# Altium schematic sheet Nucleo.SchDoc: Nucelo Shield Pinsor
size A4; Author: Tabajdi Máté; Organization: BME - AUT; DocumentNumber: 1; Revision: 19.; SheetNumber: 1; SheetTotal: 3
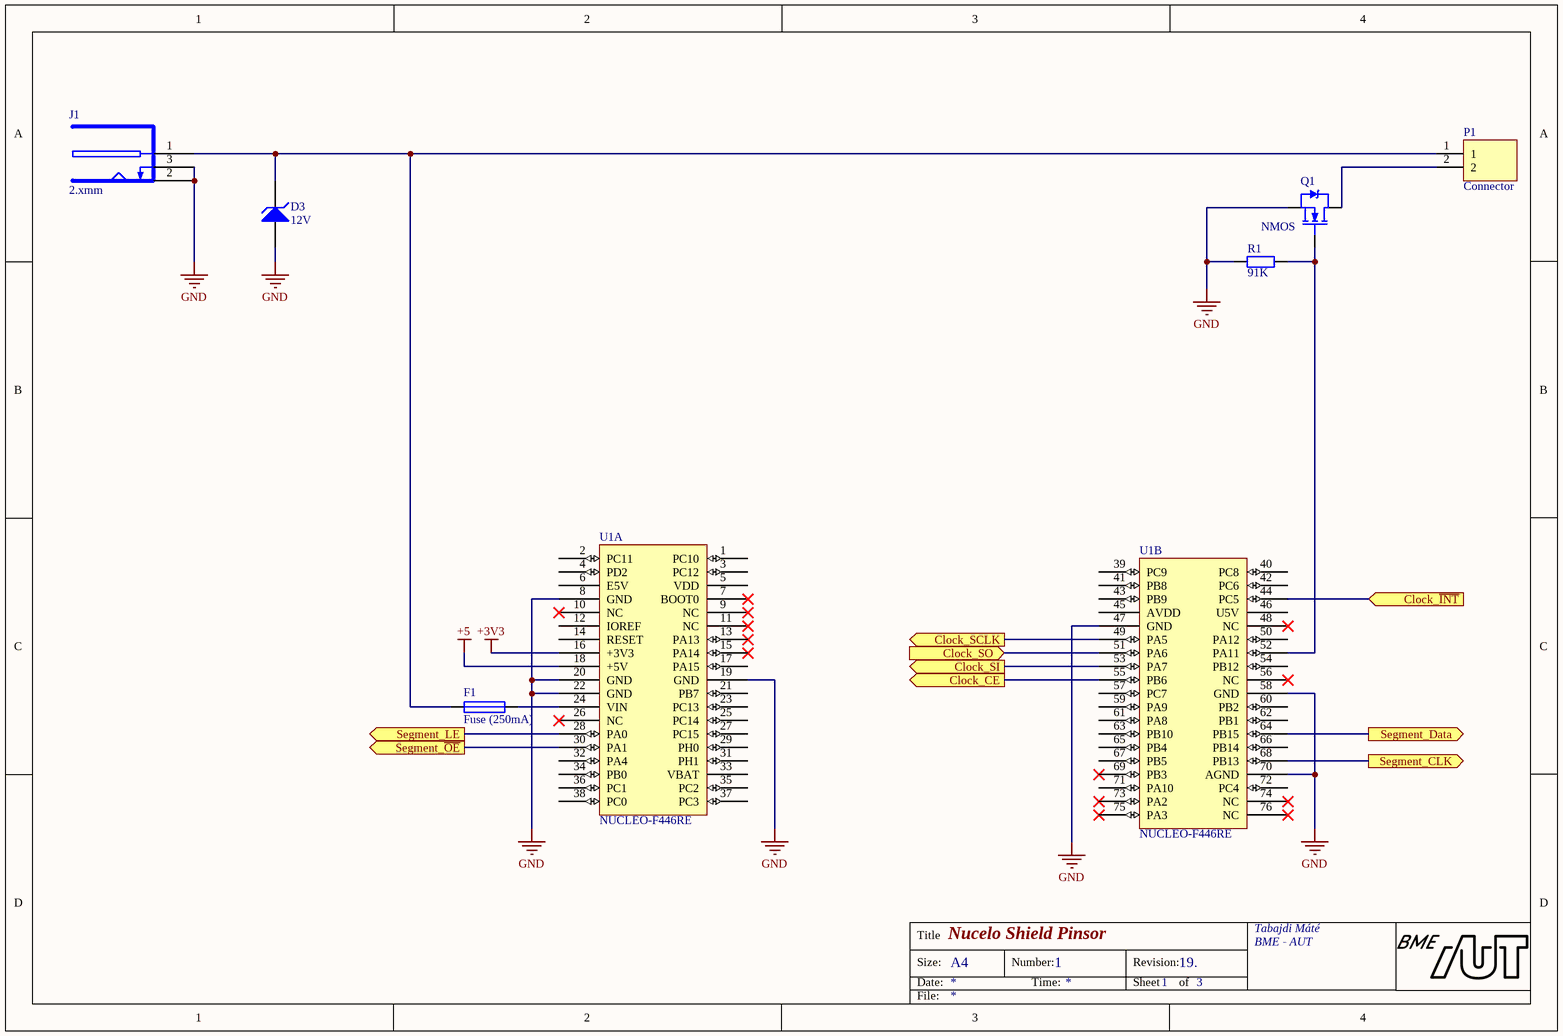
[diagram p0: Nucleo.SchDoc]

## Parts
D3  12V  [FP_SOD323-F]
F1  Fuse (250mA)  [FP_MULTIFUSE]
J1  2.xmm  [FP_DC_TAP_ANYA]
P1  Connector  [FP_CONN2_TUSKE_254MM]
Q1  NMOS  [FP_SOT23-3]
R1  91K  [FP_0805_RES]
U1  NUCLEO-F446RE  [FP_NUCLEO-64_2x20]  (parts A,B of 2)

## Ports
Clock_CE (out), Clock_SCLK (out), Clock_SI (out), Clock_SO (in), Clock_~{INT} (in), Segment_CLK (out), Segment_Data (out), Segment_LE (out), Segment_~{OE} (out)

## Nets
+3V3: U1.16(+3V3)
+5: U1.18(+5V)
GND: D3.1(A) J1.2(SLEEVE) J1.3(BREAK) Q1.3(S) R1.1 U1.8(GND) U1.19(GND) U1.20(GND) U1.22(GND) U1.47(GND) U1.58(GND) U1.70(AGND)
Clock_CE: U1.55(PB6) ; port Clock_CE
Clock_~{INT}: U1.44(PC5) ; port Clock_~{INT}
Clock_SCLK: U1.49(PA5) ; port Clock_SCLK
Clock_SI: U1.53(PA7) ; port Clock_SI
Clock_SO: U1.51(PA6) ; port Clock_SO
Segment_CLK: U1.68(PB13) ; port Segment_CLK
Segment_Data: U1.64(PB15) ; port Segment_Data
Segment_LE: U1.28(PA0) ; port Segment_LE
Segment_~{OE}: U1.30(PA1) ; port Segment_~{OE}
NetD3_2: D3.2(K) F1.1 J1.1(PIN) P1.1
NetF1_2: F1.2 U1.24(VIN)
NetP1_2: P1.2 Q1.2(D)
NetQ1_1: Q1.1(G) R1.2 U1.52(PA11)

Not connected (* = marked no-connect by the designer): U1 1(PC10) 2(PC11) 3(PC12) 4(PD2) 5(VDD) 6(E5V) 7(BOOT0)* 9(NC)* 10(NC)* 11(NC)* 12(IOREF) 13(PA13)* 14(RESET) 15(PA14)* 17(PA15) 21(PB7) 23(PC13) 25(PC14) 26(NC)* 27(PC15) 29(PH0) 31(PH1) 32(PA4) 33(VBAT) 34(PB0) 35(PC2) 36(PC1) 37(PC3) 38(PC0) 39(PC9) 40(PC8) 41(PB8) 42(PC6) 43(PB9) 45(AVDD) 46(U5V) 48(NC)* 50(PA12) 54(PB12) 56(NC)* 57(PC7) 59(PA9) 60(PB2) 61(PA8) 62(PB1) 63(PB10) 65(PB4) 66(PB14) 67(PB5) 69(PB3)* 71(PA10) 72(PC4) 73(PA2)* 74(NC)* 75(PA3)* 76(NC)*

## Notes on the sheet
- Title
- Size:
- Date:
- A4
- Number:
- Time:
- Revision:
- Sheet
- of
- File:

## Library data of the parts
D3 = ZENER: Zener Diode; Reference: 2069497; Name: TDZ12J,115 Zener diode; Supplier: Farnell; U_Z: 12V
F1 = Fuse: Reference: 2929331; Name: CC12H250MA-TR Slow Blow Fuse; Supplier: Farnell
J1 = DC_TAP_ANYA: 2.xmm DC HEBA25 TÁPFESZÜLTSÉG ALJZAT ZÁRT, NYÁKBA 90°; Name: TÁP DC ANYA 5.5/2.1/9.5mm DCS-5521-5; Supplier: Lomex; Reference: 43-07-67
P1 = Connector_2pin: 2pin connector; Name: Egysoros tüskesor; Supplier: Tanszéki forrás
Q1 = NMOS: NXP - BSP030,115 - MOSFET, N CH, 30V, 10A, SOT223; pin to pad: 2>3 3>2; Reference: 2061404; Name: DMG3414U power mosfet; Supplier: Farnell
R1 = RES: Resistor; Tolerance: 5%; Power: 0.125W; Name: 91K0 0805 5% CR-05JL7---91K 0.125W (VIK); Supplier: Lomex; Reference: 81-35-12; Value: 91K
U1 = NUCLEO-F446RE: Reference: NUCLEO; Name: Nucleo F446RE; Supplier: Tanszék